# Altium schematic sheet MCH_FPGA_Banks_64_65_HR.SchDoc: Metlino
size 420 x 297 mm; CheckedBy: P.Kulik,T.Przywozki,W.Ruclo; Author: G.Kasprowicz; CompanyName: WUT ISE; DrawnBy: G.Kasprowicz; Organization: WUT ISE; Address1: PW ISE; Address2: Nowowiejska 15/19 00-665 Warsaw; Address3: gkasprow@gmail.com; DocumentNumber: 6; Revision: 2; SheetNumber: 6; SheetTotal: 29; ModifiedBy: -; CheckedDate: -; Title2: FPGA banks - SFP, Eth, Misc; DivGrp: WUT ISE; Designer: G.Kasprowicz; ModifiedDate: -; ProjectName: Sensor Box
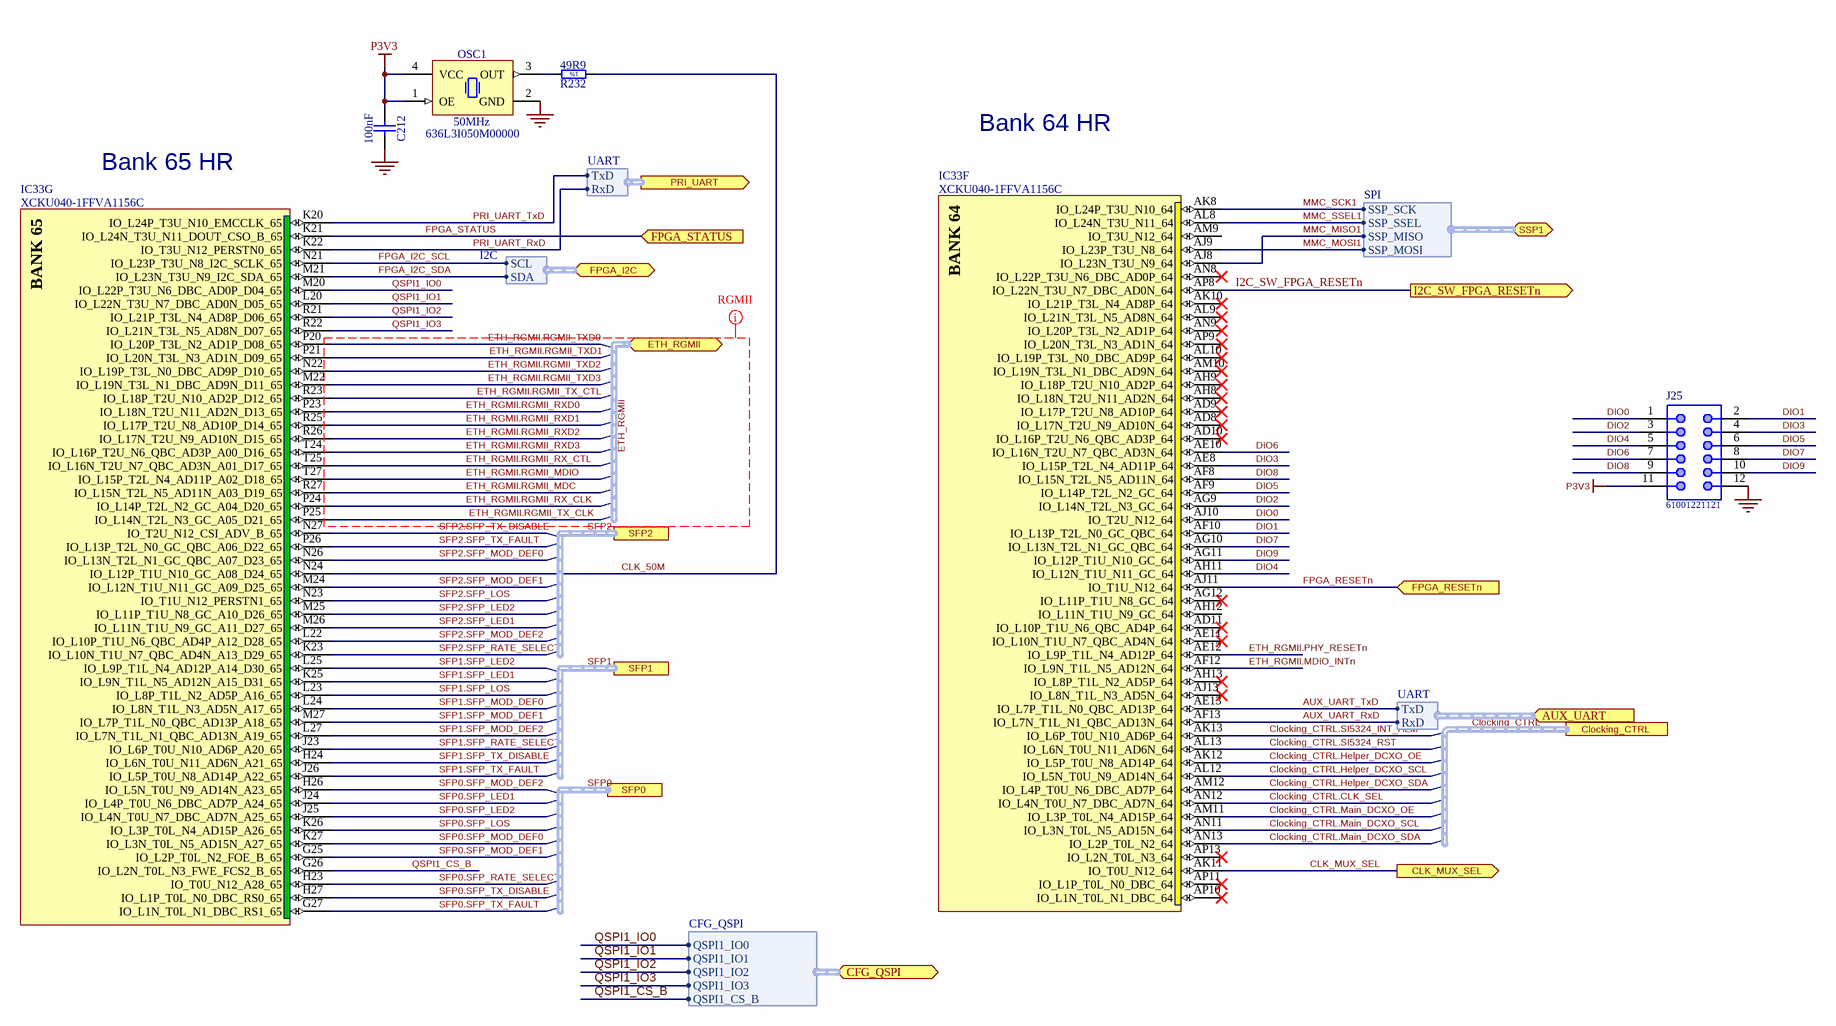
[diagram p0: MCH_FPGA_Banks_64_65_HR.SchDoc]

## Parts
C212  100nF  [CAPC0603X33N]
IC33  XCKU040-1FFVA1156C  [BGA1156C100P34X34_3500X3500X350]  (parts F,G of 22)
J25  61001221121  [61001221121]
OSC1  50MHz  Manufacturer Part Number: 636L3I050M00000  [OSCSC254P320X500X130-4N]
R232  49R9  [RESC1005X40N]

## Ports
AUX_UART (in, harness UART), CFG_QSPI (bidir, harness CFG_QSPI), CLK_MUX_SEL (out), Clocking_CTRL (harness WR_I2C_CTRL), ETH_RGMII (bidir, harness ETH_RGMII), FPGA_I2C (bidir, harness I2C), FPGA_RESETn (in), FPGA_STATUS (in), I2C_SW_FPGA_RESETn (out), PRI_UART (out, harness UART), SFP0 (harness SFP_CTL), SFP1 (harness SFP_CTL), SFP2 (harness SFP_CTL), SSP1 (bidir, harness SPI)

## Harnesses
CFG_QSPI: QSPI1_IO0, QSPI1_IO1, QSPI1_IO2, QSPI1_IO3, QSPI1_CS_B
SPI: SSP_SCK, SSP_SSEL, SSP_MISO, SSP_MOSI
UART: RxD, TxD
I2C: SCL, SDA

## Nets
GND: C212.1 J25.12 OSC1.2(GND)
P3V3: C212.2 J25.11 OSC1.1(OE) OSC1.4(VCC)
AUX_UART_RxD: IC33.AF13(IO_L7N_T1L_N1_QBC_AD13N_64) ; port AUX_UART.RxD
AUX_UART_TxD: IC33.AE13(IO_L7P_T1L_N0_QBC_AD13P_64) ; port AUX_UART.TxD
CLK_50M: IC33.N24(IO_L12P_T1U_N10_GC_A08_D24_65) R232.1
CLK_MUX_SEL: IC33.AK11(IO_T0U_N12_64) ; port CLK_MUX_SEL
Clocking_CTRL.CLK_SEL: IC33.AN12(IO_L4N_T0U_N7_DBC_AD7N_64)
Clocking_CTRL.Helper_DCXO_OE: IC33.AK12(IO_L5P_T0U_N8_AD14P_64)
Clocking_CTRL.Helper_DCXO_SCL: IC33.AL12(IO_L5N_T0U_N9_AD14N_64)
Clocking_CTRL.Helper_DCXO_SDA: IC33.AM12(IO_L4P_T0U_N6_DBC_AD7P_64)
Clocking_CTRL.Main_DCXO_OE: IC33.AM11(IO_L3P_T0L_N4_AD15P_64)
Clocking_CTRL.Main_DCXO_SCL: IC33.AN11(IO_L3N_T0L_N5_AD15N_64)
Clocking_CTRL.Main_DCXO_SDA: IC33.AN13(IO_L2P_T0L_N2_64)
Clocking_CTRL.SI5324_INT_ALM: IC33.AK13(IO_L6P_T0U_N10_AD6P_64)
Clocking_CTRL.SI5324_RST: IC33.AL13(IO_L6N_T0U_N11_AD6N_64)
DIO0: IC33.AJ10(IO_T2U_N12_64) J25.1
DIO1: IC33.AF10(IO_L13P_T2L_N0_GC_QBC_64) J25.2
DIO2: IC33.AG9(IO_L14N_T2L_N3_GC_64) J25.3
DIO3: IC33.AE8(IO_L15P_T2L_N4_AD11P_64) J25.4
DIO4: IC33.AH11(IO_L12N_T1U_N11_GC_64) J25.5
DIO5: IC33.AF9(IO_L14P_T2L_N2_GC_64) J25.6
DIO6: IC33.AE10(IO_L16N_T2U_N7_QBC_AD3N_64) J25.7
DIO7: IC33.AG10(IO_L13N_T2L_N1_GC_QBC_64) J25.8
DIO8: IC33.AF8(IO_L15N_T2L_N5_AD11N_64) J25.9
DIO9: IC33.AG11(IO_L12P_T1U_N10_GC_64) J25.10
ETH_RGMII.MDIO_INTn: IC33.AF12(IO_L9N_T1L_N5_AD12N_64)
ETH_RGMII.PHY_RESETn: IC33.AE12(IO_L9P_T1L_N4_AD12P_64)
ETH_RGMII.RGMII_MDC: IC33.R27(IO_L15N_T2L_N5_AD11N_A03_D19_65)
ETH_RGMII.RGMII_MDIO: IC33.T27(IO_L15P_T2L_N4_AD11P_A02_D18_65)
ETH_RGMII.RGMII_RX_CLK: IC33.P24(IO_L14P_T2L_N2_GC_A04_D20_65)
ETH_RGMII.RGMII_RX_CTL: IC33.T25(IO_L16N_T2U_N7_QBC_AD3N_A01_D17_65)
ETH_RGMII.RGMII_RXD0: IC33.P23(IO_L18N_T2U_N11_AD2N_D13_65)
ETH_RGMII.RGMII_RXD1: IC33.R25(IO_L17P_T2U_N8_AD10P_D14_65)
ETH_RGMII.RGMII_RXD2: IC33.R26(IO_L17N_T2U_N9_AD10N_D15_65)
ETH_RGMII.RGMII_RXD3: IC33.T24(IO_L16P_T2U_N6_QBC_AD3P_A00_D16_65)
ETH_RGMII.RGMII_TX_CLK: IC33.P25(IO_L14N_T2L_N3_GC_A05_D21_65)
ETH_RGMII.RGMII_TX_CTL: IC33.R23(IO_L18P_T2U_N10_AD2P_D12_65)
ETH_RGMII.RGMII_TXD0: IC33.P20(IO_L20P_T3L_N2_AD1P_D08_65)
ETH_RGMII.RGMII_TXD1: IC33.P21(IO_L20N_T3L_N3_AD1N_D09_65)
ETH_RGMII.RGMII_TXD2: IC33.N22(IO_L19P_T3L_N0_DBC_AD9P_D10_65)
ETH_RGMII.RGMII_TXD3: IC33.M22(IO_L19N_T3L_N1_DBC_AD9N_D11_65)
FPGA_I2C_SCL: IC33.N21(IO_L23P_T3U_N8_I2C_SCLK_65) ; port FPGA_I2C.SCL
FPGA_I2C_SDA: IC33.M21(IO_L23N_T3U_N9_I2C_SDA_65) ; port FPGA_I2C.SDA
FPGA_RESETn: IC33.AJ11(IO_T1U_N12_64) ; port FPGA_RESETn
FPGA_STATUS: IC33.K21(IO_L24N_T3U_N11_DOUT_CSO_B_65) ; port FPGA_STATUS
I2C_SW_FPGA_RESETn: IC33.AP8(IO_L22N_T3U_N7_DBC_AD0N_64) ; port I2C_SW_FPGA_RESETn
MMC_MISO1: IC33.AJ8(IO_L23N_T3U_N9_64) ; port SSP1.SSP_MISO
MMC_MOSI1: IC33.AJ9(IO_L23P_T3U_N8_64) ; port SSP1.SSP_MOSI
MMC_SCK1: IC33.AK8(IO_L24P_T3U_N10_64) ; port SSP1.SSP_SCK
MMC_SSEL1: IC33.AL8(IO_L24N_T3U_N11_64) ; port SSP1.SSP_SSEL
PRI_UART_RxD: IC33.K22(IO_T3U_N12_PERSTN0_65) ; port PRI_UART.RxD
PRI_UART_TxD: IC33.K20(IO_L24P_T3U_N10_EMCCLK_65) ; port PRI_UART.TxD
QSPI1_CS_B: IC33.G26(IO_L2N_T0L_N3_FWE_FCS2_B_65) ; port CFG_QSPI.QSPI1_CS_B
QSPI1_IO0: IC33.M20(IO_L22P_T3U_N6_DBC_AD0P_D04_65) ; port CFG_QSPI.QSPI1_IO0
QSPI1_IO1: IC33.L20(IO_L22N_T3U_N7_DBC_AD0N_D05_65) ; port CFG_QSPI.QSPI1_IO1
QSPI1_IO2: IC33.R21(IO_L21P_T3L_N4_AD8P_D06_65) ; port CFG_QSPI.QSPI1_IO2
QSPI1_IO3: IC33.R22(IO_L21N_T3L_N5_AD8N_D07_65) ; port CFG_QSPI.QSPI1_IO3
SFP0.SFP_LED1: IC33.J24(IO_L4P_T0U_N6_DBC_AD7P_A24_65)
SFP0.SFP_LED2: IC33.J25(IO_L4N_T0U_N7_DBC_AD7N_A25_65)
SFP0.SFP_LOS: IC33.K26(IO_L3P_T0L_N4_AD15P_A26_65)
SFP0.SFP_MOD_DEF0: IC33.K27(IO_L3N_T0L_N5_AD15N_A27_65)
SFP0.SFP_MOD_DEF1: IC33.G25(IO_L2P_T0L_N2_FOE_B_65)
SFP0.SFP_MOD_DEF2: IC33.H26(IO_L5N_T0U_N9_AD14N_A23_65)
SFP0.SFP_RATE_SELECT: IC33.H23(IO_T0U_N12_A28_65)
SFP0.SFP_TX_DISABLE: IC33.H27(IO_L1P_T0L_N0_DBC_RS0_65)
SFP0.SFP_TX_FAULT: IC33.G27(IO_L1N_T0L_N1_DBC_RS1_65)
SFP1.SFP_LED1: IC33.K25(IO_L9N_T1L_N5_AD12N_A15_D31_65)
SFP1.SFP_LED2: IC33.L25(IO_L9P_T1L_N4_AD12P_A14_D30_65)
SFP1.SFP_LOS: IC33.L23(IO_L8P_T1L_N2_AD5P_A16_65)
SFP1.SFP_MOD_DEF0: IC33.L24(IO_L8N_T1L_N3_AD5N_A17_65)
SFP1.SFP_MOD_DEF1: IC33.M27(IO_L7P_T1L_N0_QBC_AD13P_A18_65)
SFP1.SFP_MOD_DEF2: IC33.L27(IO_L7N_T1L_N1_QBC_AD13N_A19_65)
SFP1.SFP_RATE_SELECT: IC33.J23(IO_L6P_T0U_N10_AD6P_A20_65)
SFP1.SFP_TX_DISABLE: IC33.H24(IO_L6N_T0U_N11_AD6N_A21_65)
SFP1.SFP_TX_FAULT: IC33.J26(IO_L5P_T0U_N8_AD14P_A22_65)
SFP2.SFP_LED1: IC33.M26(IO_L11N_T1U_N9_GC_A11_D27_65)
SFP2.SFP_LED2: IC33.M25(IO_L11P_T1U_N8_GC_A10_D26_65)
SFP2.SFP_LOS: IC33.N23(IO_T1U_N12_PERSTN1_65)
SFP2.SFP_MOD_DEF0: IC33.N26(IO_L13N_T2L_N1_GC_QBC_A07_D23_65)
SFP2.SFP_MOD_DEF1: IC33.M24(IO_L12N_T1U_N11_GC_A09_D25_65)
SFP2.SFP_MOD_DEF2: IC33.L22(IO_L10P_T1U_N6_QBC_AD4P_A12_D28_65)
SFP2.SFP_RATE_SELECT: IC33.K23(IO_L10N_T1U_N7_QBC_AD4N_A13_D29_65)
SFP2.SFP_TX_DISABLE: IC33.N27(IO_T2U_N12_CSI_ADV_B_65)
SFP2.SFP_TX_FAULT: IC33.P26(IO_L13P_T2L_N0_GC_QBC_A06_D22_65)
NetOSC1_3: OSC1.3(OUT) R232.2

Not connected (* = marked no-connect by the designer): IC33 AD8(IO_L17N_T2U_N9_AD10N_64)* AD9(IO_L17P_T2U_N8_AD10P_64)* AD10(IO_L16P_T2U_N6_QBC_AD3P_64)* AD11(IO_L10P_T1U_N6_QBC_AD4P_64)* AE11(IO_L10N_T1U_N7_QBC_AD4N_64)* AG12(IO_L11P_T1U_N8_GC_64)* AH8(IO_L18N_T2U_N11_AD2N_64)* AH9(IO_L18P_T2U_N10_AD2P_64)* AH12(IO_L11N_T1U_N9_GC_64) AH13(IO_L8P_T1L_N2_AD5P_64)* AJ13(IO_L8N_T1L_N3_AD5N_64)* AK10(IO_L21P_T3L_N4_AD8P_64)* AL9(IO_L21N_T3L_N5_AD8N_64)* AL10(IO_L19P_T3L_N0_DBC_AD9P_64)* AM9(IO_T3U_N12_64) AM10(IO_L19N_T3L_N1_DBC_AD9N_64)* AN8(IO_L22P_T3U_N6_DBC_AD0P_64)* AN9(IO_L20P_T3L_N2_AD1P_64)* AP9(IO_L20N_T3L_N3_AD1N_64)* AP10(IO_L1N_T0L_N1_DBC_64)* AP11(IO_L1P_T0L_N0_DBC_64)* AP13(IO_L2N_T0L_N3_64)*

## Buses and harness runs
harness Clocking_CTRL = port Clocking_CTRL
harness ETH_RGMII = port ETH_RGMII
harness SFP0 = port SFP0
harness SFP1 = port SFP1
harness SFP2 = port SFP2

## Layout directives
net class RGMII: ETH_RGMII, ETH_RGMII.RGMII_MDC, ETH_RGMII.RGMII_MDIO, ETH_RGMII.RGMII_RX_CLK, ETH_RGMII.RGMII_RX_CTL, ETH_RGMII.RGMII_RXD0, ETH_RGMII.RGMII_RXD1, ETH_RGMII.RGMII_RXD2, ETH_RGMII.RGMII_RXD3, ETH_RGMII.RGMII_TX_CLK, ETH_RGMII.RGMII_TX_CTL, ETH_RGMII.RGMII_TXD0, ETH_RGMII.RGMII_TXD1, ETH_RGMII.RGMII_TXD2, ETH_RGMII.RGMII_TXD3

## Notes on the sheet
- Bank 64 HR
- Bank 65 HR
- Project/Equipment
- Document
- Designer
- Drawn by
- Check.by
- Copyright WUT ISE 2018.
  This documentation describes Open Hardware and is licensed under the CERN OHL v.1.1. You may redistribute and modify this documentation under the terms of the CERN OHL v.1.1. (http://ohwr.org/CERNOHL). This documentation is distributed WITHOUT ANY EXPRESS OR IMPLIED WARRANTY, INCLUDING OF MERCHANTABILITY, SATISFACTORY QUALITY AND FITNESS FOR A PARTICULAR PURPOSE. Please see the CERN OHL v.1.1 for applicable conditions.
- Contact
- File
- Last Mod.
- Print Date
- Sheet
- Size
- A3
- of
- Rev
- (in symbol R0402_49R9_1%_0.0625W_100PPM) 1%
- (in symbol XCKU040-1FFVA1156C, part F) BANK 64
- (in symbol XCKU040-1FFVA1156C, part G) BANK 65

## Library data of the parts
C212 = CC0201_100NF_6.3V_10%_X5R: Non-polarised capacitor; Manufacturer: GENERIC; Part Description: SMD Multilayer Chip Ceramic Capacitor; Manufacturer1 Part Number: 02016D104KAT2A; Tolerance: ±10%; Voltage: 6.3V; TC: X5R; Manufacturer Part Number: CC0201_100NF_6.3V_10%_X5R; Part Number: CC0201_100NF_6.3V_10%_X5R; Value: 100nF; Component Kind: Standard; Component Type: Standard; Pin Count: 2; Status: Not Recommended; Case: 0201; Mounted: Yes; Socket: No; SMD: Yes; Sense: No; Manufacturer1 Example: AVX; Manufacturer1 ComponentHeight: 0.33mm; HelpURL: \\cern.ch\dfs\Applications\Altium\Datasheets\CC0201_X5R_AVX.pdf; Author: CERN DEM JLC; CreateDate: 03.12.2007; LatestRevisionDate: 03.12.2007
IC33 = XCKU040-1FFVA1156C: Kintex UltraScale FPGA, 520 I/O, 530K Cells, 1156-Ball BGA, Speed Grade 1, Commercial Grade; Manufacturer: XILINX; Part Description: Kintex UltraScale, 40 DLL I/O, 416 HP I/O, 104 HR I/O, 1156-Pin BGA, Speed Grade 1, Commercial Grade; PressFit: No; Bonding: No; Manufacturer Part Number: XCKU040-1FFVA1156C; PackageDescription: BGA, 1.00mm Pitch, Square; 1156 Pin, 34 Columns X 34 Rows, Body 35.00mm X 35.00mm X 3.50mm H, IPC Medium Density; Part Number: XCKU040-1FFVA1156C; Component Kind: Standard; Component Type: Standard; Device: XCKU040-1FFVA1156C; Pin Count: 1156; Case: BGA1156; Mounted: Yes; Socket: No; SMD: Yes; Sense: No; ComponentHeight: 3.5mm; HelpURL: \\cern.ch\dfs\Applications\Altium\Datasheets\XCKU040-1FFVA1156C.pdf; ComponentLink1URL: \\cern.ch\dfs\Applications\Altium\Datasheets\XCKU040-1FFVA1156C_Package-Pinout.pdf; ComponentLink1Description: Package/Pinout; Author: CERN DEM CA; CreateDate: 16.08.2016; LatestRevisionDate: 16.08.2016
J25 = 61001221121: WR-PHD Pin Header, SMT, pitch 2.54mm, Dual Row, Vertical, 12p; Manufacturer: Wurth Elektronik; Pin Number: 12; Rated Current: 3A; Working Voltage: 250VAC; Withstanding Voltage: 500VAC; Contact Resistance: 20mOhm; ComponentLink1Description: Manufacturer; ComponentLink1URL: http://www.we-online.de; ComponentLink2Description: Datasheet; ComponentLink2URL: https://www.we-online.com/catalog/datasheet/61001221121.pdf; Manufacturer Part Number: 61001221121; Published Date: May 2020; Pitch: 2.54mm; Operating Temperature: -40 to +125degC; Mounting Technology: SMT; Packaging: Tube; Gender: Pin Header; Row Number: Dual; Orientation: Vertical
OSC1 = OSC_50MHZ_CTS_636L3I050M00000: Oscillator 4 pins 1=OE 2=GND 3=OUT 4=VCC; Manufacturer: CTS ELECTRONIC COMPONENTS; Part Description: 3.3V, ±50ppm, 30pF, -40..85°C, HCMOS/TTL Clock Oscillator, 636 Series; PressFit: No; Bonding: No; PackageDescription: Oscillator, Side Concave; 2.54mm Pitch; 4 pin, 3.20mm L X 5.00mm W X 1.30mm H, IPC Medium Density; Part Number: OSC_50MHZ_CTS_636L3I050M00000; Value: 50MHz; Component Kind: Standard; Component Type: Standard; Pin Count: 4; Mounted: Yes; Socket: No; SMD: Yes; Sense: No; ComponentHeight: 1.3mm; HelpURL: \\cern.ch\dfs\Applications\Altium\Datasheets\OSC_CTS_636.pdf; Author: CERN DEM JMW; CreateDate: 22.09.2015; LatestRevisionDate: 22.09.2015
R232 = R0402_49R9_1%_0.0625W_100PPM: Resistor - 1%; Manufacturer: GENERIC; Part Description: General Purpose Thick Film Chip Resistor; Manufacturer1 Part Number: 232270674999L or RC0402FR-0749R9L; TC: ±100ppm/°C; PressFit: No; Manufacturer Part Number: R0402_49R9_1%_0.0625W_100PPM; Part Number: R0402_49R9_1%_0.0625W_100PPM; Tolerance: ±1%; Value: 49R9; Component Kind: Standard; Component Type: Standard; Pin Count: 2; Status: Not Recommended; Power: 0.0625W; Case: 0402; Mounted: Yes; Sense: No; Socket: No; SMD: Yes; Manufacturer1 Example: YAGEO PHYCOMP; Manufacturer1 ComponentHeight: 0.4mm; HelpURL: \\cern.ch\dfs\Applications\Altium\Datasheets\R0402_Phycomp_RC0402.pdf; Author: CERN DEM JLC; CreateDate: 24.10.2012; LatestRevisionDate: 24.10.2012